# EasyEDA Pro project MasterCtrl.eprj, schematic MasterSchematic

## Sheets
1 MasterCore: Board Name: Board1; Create Date: 2025-06-09; Page Name: MasterCore; Project Name: MasterCtrl_v1_0_4; Schematic Name: Schematic1; Update Date: 2025-06-09; Company: 嘉立创EDA; Drawed: 王大智; Page Size: A4; Version: V1.0
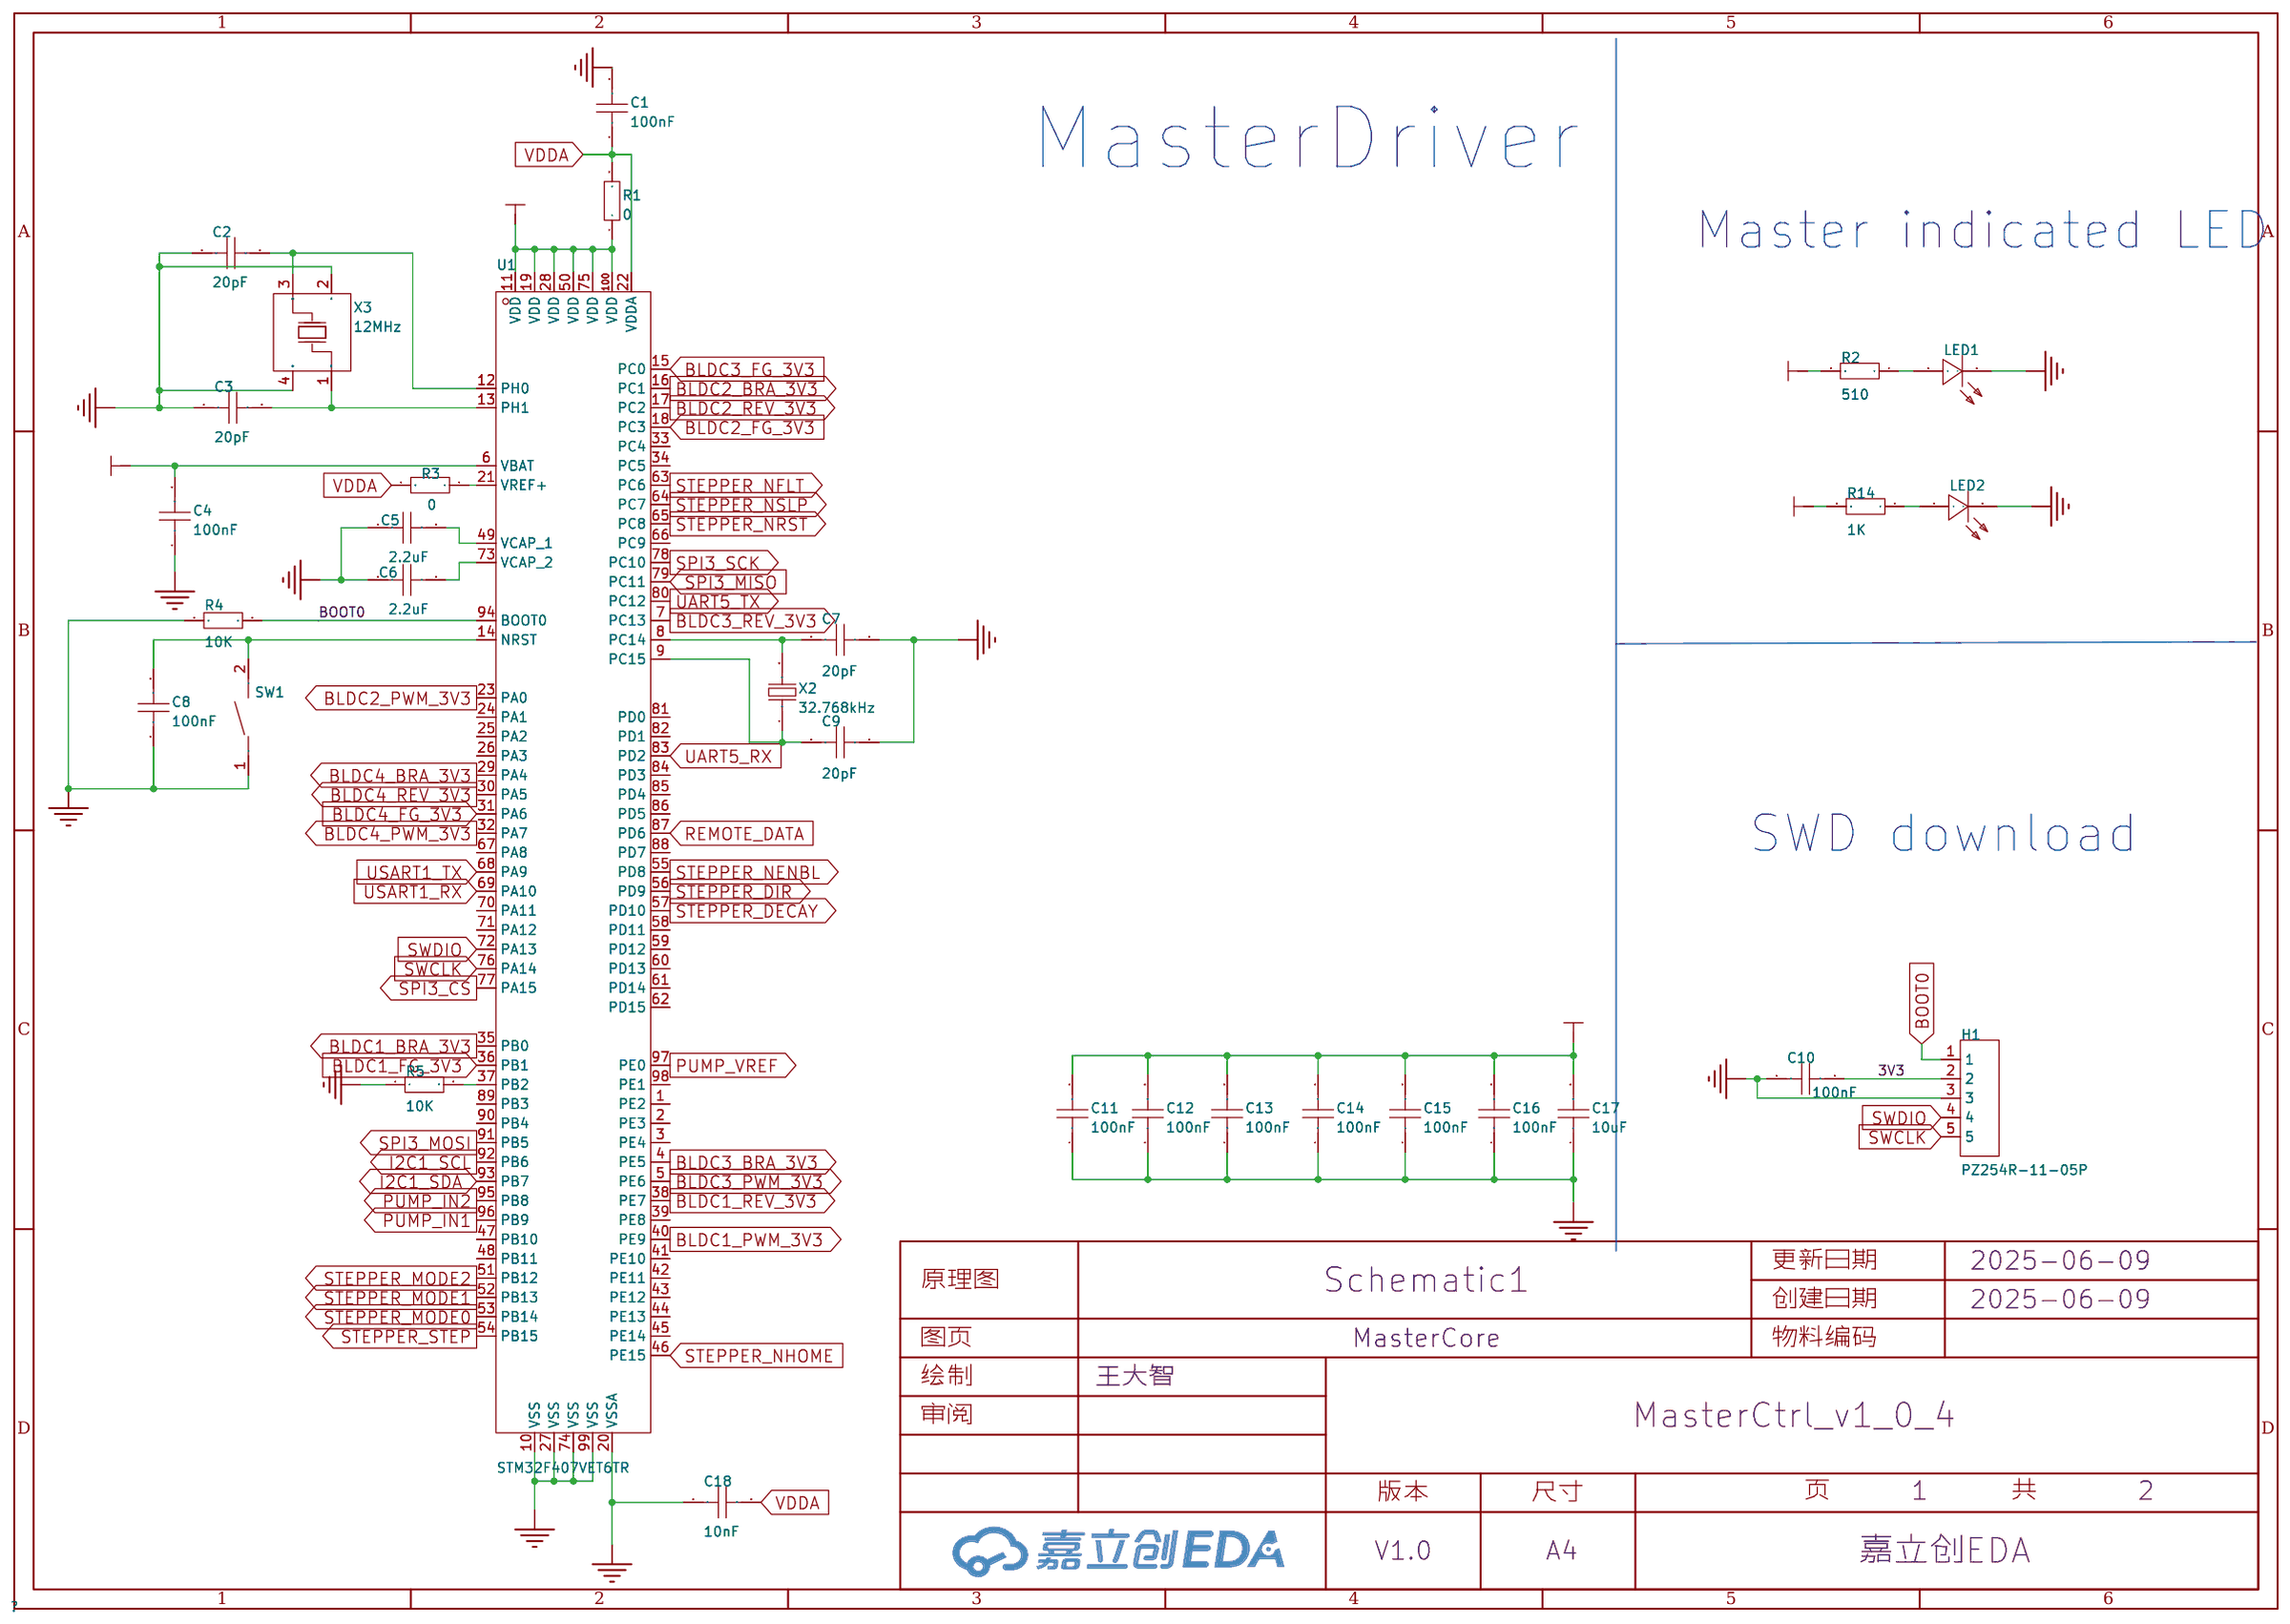
[diagram p0: MasterCore]
2 MasterExternal: Page Name: ExternalCircuit
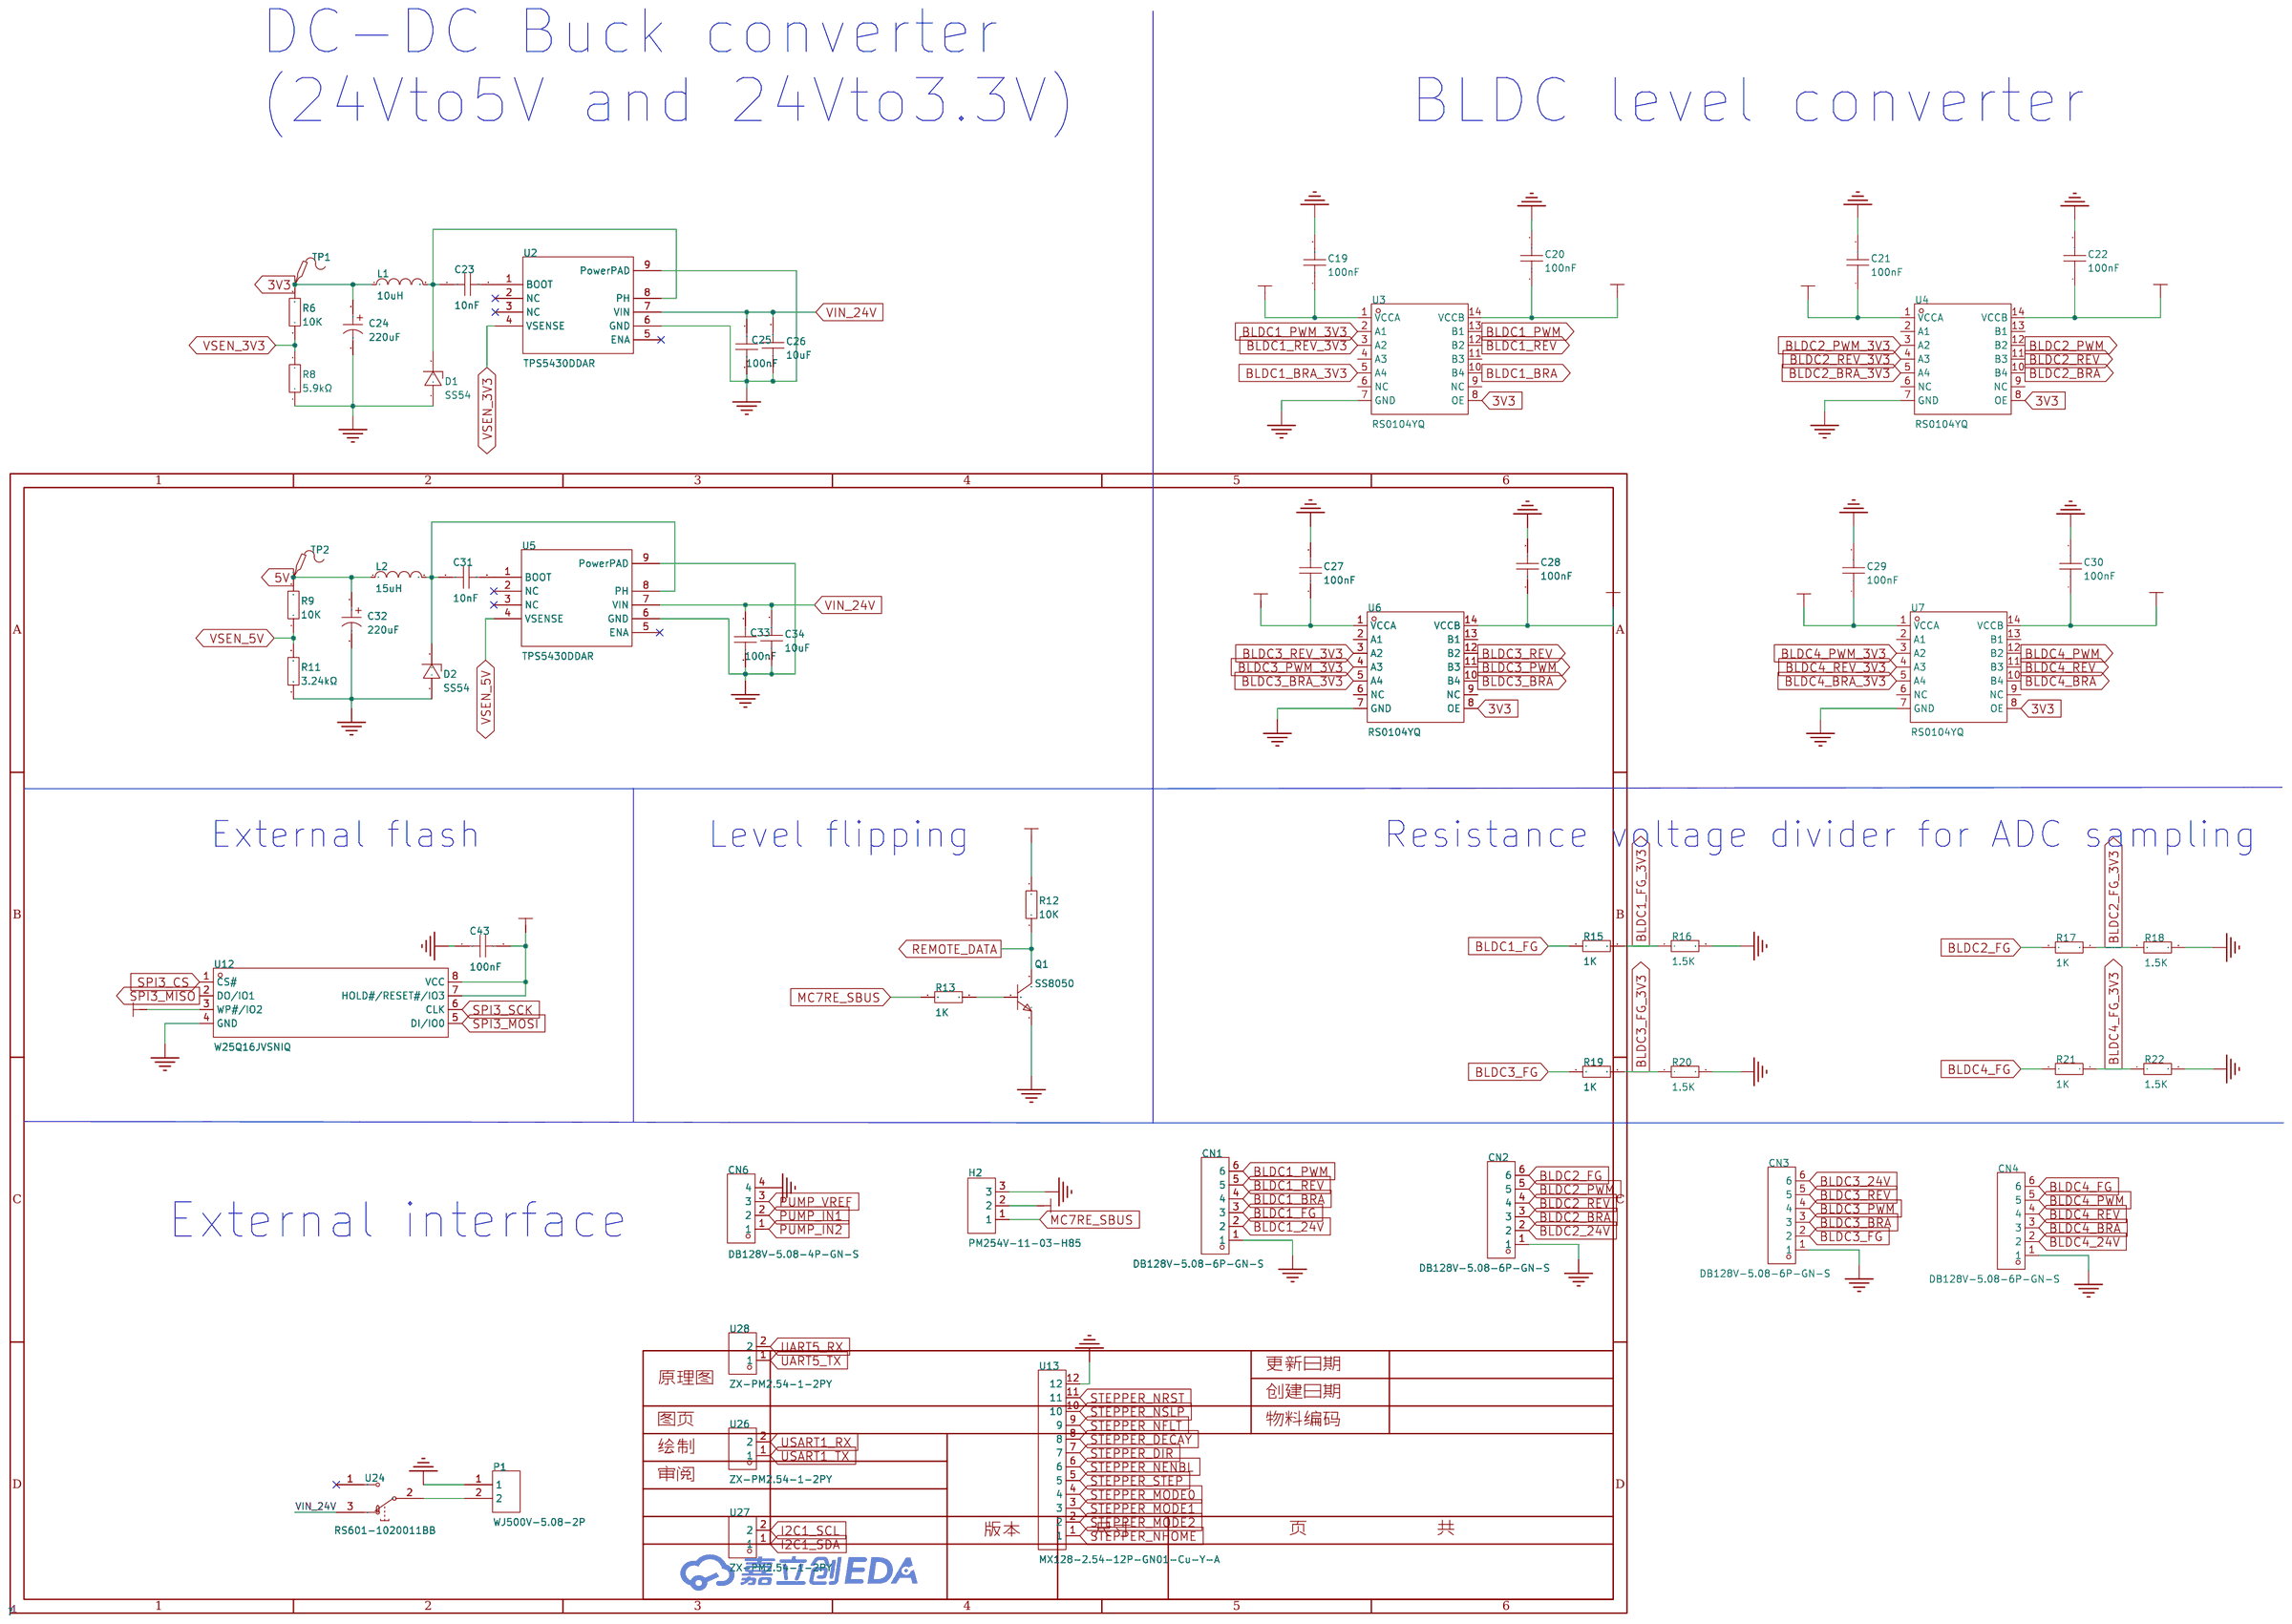
[diagram p1: MasterExternal]

## Parts
sheet MasterCore
C1  100nF  [C0603]
C2  20pF  [C0603]
C3  20pF  [C0603]
C4  100nF  [C0603]
C5  2.2uF  [C0603]
C6  2.2uF  [C0603]
C7  20pF  [C0603]
C8  100nF  [C0603]
C9  20pF  [C0603]
C10  100nF  [C0603]
C11  100nF  [C0603]
C12  100nF  [C0603]
C13  100nF  [C0603]
C14  100nF  [C0603]
C15  100nF  [C0603]
C16  100nF  [C0603]
C17  10uF  [C0603]
C18  10nF  [C0603]
H1  PZ254R-11-05P  [HDR-TH_5P-P2.54-H-M-W10.4]
LED1  SZYY0805R  [LED0805-R-RD]
LED2  SZYY0805R  [LED0805-R-RD]
R1  0  [R0603]
R2  510  [R0603]
R3  0  [R0603]
R4  10K  [R0603]
R5  10K  [R0603]
R14  1K  [R0603]
SW1  TS-1088-AR02016  [SW-SMD_L3.9-W3.0-P4.45]
U1  STM32F407VET6TR  [LQFP-100_L14.0-W14.0-P0.50-LS16.0-BL]
X2  32.768kHz  [FC-135R_L3.2-W1.5]
X3  12MHz  [CRYSTAL-SMD_4P-L3.2-W2.5-BL]
sheet MasterExternal
C19  100nF  [C0603]
C20  100nF  [C0603]
C21  100nF  [C0603]
C22  100nF  [C0603]
C23  10nF  [C0603]
C24  220uF  [CAP-SMD_BD8.0-L8.3-W8.3-FD]
C25  100nF  [C0603]
C26  10uF  [C1206]
C27  100nF  [C0603]
C28  100nF  [C0603]
C29  100nF  [C0603]
C30  100nF  [C0603]
C31  10nF  [C0603]
C32  220uF  [CAP-SMD_BD8.0-L8.3-W8.3-FD]
C33  100nF  [C0603]
C34  10uF  [C1206]
C43  100nF  [C0603]
CN1  DB128V-5.08-6P-GN-S  [CONN-TH_6P-P5.08_DIBO_DB128V-5.08]
CN2  DB128V-5.08-6P-GN-S  [CONN-TH_6P-P5.08_DIBO_DB128V-5.08]
CN3  DB128V-5.08-6P-GN-S  [CONN-TH_6P-P5.08_DIBO_DB128V-5.08]
CN4  DB128V-5.08-6P-GN-S  [CONN-TH_6P-P5.08_DIBO_DB128V-5.08]
CN6  DB128V-5.08-4P-GN-S  [CONN-TH_4P-P5.08_DIBO_DB128V-5.08]
D1  SS54  [SMA_L4.3-W2.6-LS5.0-FD]
D2  SS54  [SMA_L4.3-W2.6-LS5.0-FD]
H2  PM254V-11-03-H85  [HDR-TH_3P-P2.54-V-F]
L1  10uH  [IND-SMD_L7.3-W6.8]
L2  15uH  [IND-SMD_L7.0-W6.6_FXL0630]
P1  WJ500V-5.08-2P  [CONN-TH_2P-P5.00_WJ500V-5.08-2P]
Q1  SS8050  [SOT-23-3_L2.9-W1.3-P1.90-LS2.4-BR]
R6  10K  [R0603]
R8  5.9kΩ  [R0603]
R9  10K  [R0603]
R11  3.24kΩ  [R0603]
R12  10K  [R0603]
R13  1K  [R0603]
R15  1K  [R0603]
R16  1.5K  [R0603]
R17  1K  [R0603]
R18  1.5K  [R0603]
R19  1K  [R0603]
R20  1.5K  [R0603]
R21  1K  [R0603]
R22  1.5K  [R0603]
TP1  -  [Test-Point-0.5mm]
TP2  -  [Test-Point-0.5mm]
U2  TPS5430DDAR  [ESOP-8_L4.9-W3.9-P1.27-LS6.0-TL-EP]
U3  RS0104YQ  [TSSOP-14_L5.0-W4.4-P0.65-LS6.4-BL]
U4  RS0104YQ  [TSSOP-14_L5.0-W4.4-P0.65-LS6.4-BL]
U5  TPS5430DDAR  [ESOP-8_L4.9-W3.9-P1.27-LS6.0-TL-EP]
U6  RS0104YQ  [TSSOP-14_L5.0-W4.4-P0.65-LS6.4-BL]
U7  RS0104YQ  [TSSOP-14_L5.0-W4.4-P0.65-LS6.4-BL]
U12  W25Q16JVSNIQ  [SOP-8_L4.9-W3.9-P1.27-LS6.0-BL]
U13  MX128-2.54-12P-GN01-Cu-Y-A  [CONN-TH_12P-P2.54_MX128-2.54-12P-GN01-CU-Y-A]
U24  RS601-1020011BB  [SW-TH_RS601-1020011BB]
U26  ZX-PM2.54-1-2PY  [HDR-TH_2P-P2.54-V-F]
U27  ZX-PM2.54-1-2PY  [HDR-TH_2P-P2.54-V-F]
U28  ZX-PM2.54-1-2PY  [HDR-TH_2P-P2.54-V-F]

## Library data of the parts
C1-C23 C25 C27-C31 C33 C43 = CAP_0603: Supplier Footprint: 0603
H1 = PZ254R-11-05P: 插针结构:1x5P;间距:2.54mm;行距:-;圆针/方针:方针;安装方式:弯插;排数:单排;总PIN位数:5P;额定电流:-;额定电压:-;配合针长度:6mm;塑高:2.5mm;触头材质:黄铜;触头镀层:-;工作温度:-40℃~+105℃;颜色:黑色;; LCSC Part Name: 1x5P 间距:2.54mm 方针 弯插; Supplier Part: C492413; Manufacturer: XFCN(兴飞); Supplier Footprint: 弯插,P=2.54mm; JLCPCB Part Class: 扩展库; Datasheet: https://atta.szlcsc.com/upload/public/pdf/source/20200309/C492413_82088D06BDD816AEC12FB986624DD327.pdf; Supplier: LCSC; Pin Structure: 1x5P; Pitch: 2.54mm; Circluar Pins/Square Pins: 方针; Mounting Type: 弯插; Number of Rows: 单排; Number of Pins: 5P; Length of Mating Pin: 6mm; Insulation Height: 2.5mm; Contact Material: 黄铜; Operating Temperature: -40℃~+105℃; Color: 黑色
LED1 LED2 = SZYY0805R: 发光颜色:红色;功率:40mW;正向电流:10mA;主波长:615nm~630nm;二极管配置:-;透镜颜色:无色透明透镜;色温:-;发光角度:120°;载带方式:-;工作温度:-40℃~+85℃;; LCSC Part Name: 红灯; Supplier Part: C434431; Manufacturer: yongyu(永裕光电); Supplier Footprint: 0805; JLCPCB Part Class: 扩展库; Datasheet: https://atta.szlcsc.com/upload/public/pdf/source/20191204/C434431_431C171B758FE4C37FA40B1B295AA7AB.pdf; Supplier: LCSC; Emitted Color: 红色; Power Dissipation: 40mW; Forward Current: 10mA; Dominant Wavelength: 615nm~630nm; Peak Wavelength: 645nm; Lens Color: 无色透明透镜; Viewing Angle: 120°; Operating Temperature: -40℃~+85℃
R1-R6 R9 R12-R22 = Res_0603: Supplier Footprint: 0603
SW1 = TS-1088-AR02016: 电路结构:单刀单掷;按钮形状:圆形按钮;作用力:160gf;安装方式:立贴;开关长度:4mm;开关宽度:3mm;开关高度:2mm;带支架:不带;触点电流:50mA;额定电压(DC):12V;绝缘电阻:100MΩ;机械寿命:10万次;; LCSC Part Name: 4*3*2mm 立贴 轻触开关; Supplier Part: C720477; Manufacturer: XUNPU(讯普); Supplier Footprint: SMD; JLCPCB Part Class: 扩展库; Datasheet: https://atta.szlcsc.com/upload/public/pdf/source/20200810/C720475_60D09DD6C54279ADDB2DC25100F1CC11.pdf; Supplier: LCSC; Circuit: 单刀单掷; Actuator Style: 圆形按钮; Operating Force: 160gf; Mounting Style: 立贴; Switch Length: 4mm; Switch Width: 3mm; Switch Height: 2mm; Strike Gundam: 不带; Contact Current: 50mA; Voltage Rating (DC): 12V; Insulation Resistance: 100MΩ; Actuator/Cap Color: 黑色; Pin Style: SMD接片; Mechanical Life: 10万次; Operating Temperature: -30℃~+80℃
U1 = STM32F407VET6TR: CPU内核:ARM-M4;CPU最大主频:168MHz;应用领域:-;; LCSC Part Name: 带DSP和FPU的高性能基础系列ARM Cortex-M4 MCU，具有512 KB Flash、168 MHz CPU、ART加速器、以太网和FSMC; Supplier Part: C5269943; Manufacturer: ST(意法半导体); Supplier Footprint: LQFP-100(14x14); JLCPCB Part Class: 扩展库; Datasheet: https://atta.szlcsc.com/upload/public/pdf/source/20201130/C919362_39400D478C258148B3DF984CE4A4041A.pdf; Supplier: LCSC; CPU Core: ARM-M4; CPU Maximum Speed: 168MHz; Number of I/O: 82; ADC (Bit): 12bit; DAC (Bit): 12bit; Low Voltage Detection Threshold: 1.8V~3.6V
X2 = Q13FC13500004_C32346: 晶振类型:贴片晶振;频率:32.768kHz;常温频差:±20ppm;负载电容:12.5pF;; LCSC Part Name: 32.768kHz ±20ppm 12.5pF; Supplier Part: C32346; Manufacturer: EPSON(爱普生); Manufacturer Part: Q13FC13500004; Supplier Footprint: SMD3215-2P; JLCPCB Part Class: 基础库; Datasheet: https://atta.szlcsc.com/upload/public/pdf/source/20240418/0E0FF5F0356BA3753F616001439D1416.pdf; Supplier: LCSC; Crystal Type: 贴片晶振; Normal temperature Frequency Tolerance: ±20ppm; Load Capacitor: 12.5pF; Equivalent Series Resistance (ESR): 70kΩ; Operating Temperature: -40℃~+85℃
X3 = X322512MSB4SI: 晶振类型:贴片晶振;频率:12MHz;常温频差:±10ppm;负载电容:20pF;频率稳定度:±20ppm;; LCSC Part Name: YSX321SL 12MHZ 4P 3225 20PF ±10PPM -40~85℃ (±20PPM); Supplier Part: C9002; Manufacturer: YXC(扬兴晶振); Supplier Footprint: SMD3225-4P; JLCPCB Part Class: 基础库; Datasheet: https://atta.szlcsc.com/upload/public/pdf/source/20240329/19D5F850207469550BEB00D7DFEDBC7A.pdf; Supplier: LCSC; Type: 贴片晶振; Normal temperature Frequency Tolerance: ±10ppm; Load Capacitance: 20pF; Frequency Stability: ±20ppm; Operating Temperature: -40℃~+85℃
C24 C32 = GVT1V227M0810CNVC: 容值:220uF;精度:±20%;额定电压:35V;纹波电流:175mA@120Hz;; LCSC Part Name: 220uF ±20% 35V; Supplier Part: C2983323; Manufacturer: HRK(鸿瑞凯电子); Supplier Footprint: SMD,D8xL10.5mm; JLCPCB Part Class: 扩展库; Datasheet: https://atta.szlcsc.com/upload/public/pdf/source/20220321/BA17E910A44EA2B508CDD6AB8BA576BA.pdf; Supplier: LCSC; Tolerance: ±20%; Rated Voltage: 35V; Ripple Current: 175mA@120Hz; φD: 8mm; L: 10.5mm; Lifetime @ Temp: 2000hrs@105℃; Operating Temperature: -55℃~+105℃
C26 C34 = HGC1206R5106K500NSPJ: 容值:10uF;精度:±10%;额定电压:50V;温度系数:X5R;; LCSC Part Name: 10uF ±10% 50V; Supplier Part: C7432781; Manufacturer: Chinocera(华瓷); Supplier Footprint: 1206; JLCPCB Part Class: 扩展库; Datasheet: https://atta.szlcsc.com/upload/public/pdf/source/20240320/FAC3FEC40A78BC5CCCE96C232A94D860.pdf; Supplier: LCSC; Tolerance: ±10%; Voltage Rating: 50V; Temperature Coefficient: X5R
CN1-CN4 = DB128V-5.08-6P-GN-S: 结构:1x6P;间距:5.08mm;颜色:绿色;安装方式:直插;额定电流:20A;额定电压:300V;排数:1;线规 - AWG:12~30;线规 - 平方毫米:2.5;每排PIN数:6;工作温度范围:-40℃~+105℃;; LCSC Part Name: 5.08mm 1x6P 排数:1 每排P数:6 直插; Supplier Part: C2915642; Manufacturer: DORABO(地博电气); Supplier Footprint: 插件,P=5.08mm; JLCPCB Part Class: 扩展库; Datasheet: https://atta.szlcsc.com/upload/public/pdf/source/20230106/CC449C10514519CDCE20F1C37DBF2DAC.pdf; Supplier: LCSC; Structure: 1x6P; Pitch: 5.08mm; Color: 绿色; Mounting Style: 直插; Current Rating (Max): 20A; Voltage Rating (Max): 300V; Number of Pins: 6P; Number of Rows: 1; Wire Gauge - AWG: 12~30; Wire Gauge - mm2: 2.5; Number of PINs Per Row: 6; Operating Temperature Range: -40℃~+105℃
CN6 = DB128V-5.08-4P-GN-S: 结构:1x4P;间距:5.08mm;颜色:绿色;安装方式:直插;排数:1;每排PIN数:4;额定电流:16A;额定电压:300V;线规 - AWG:12~22;线规 - 平方毫米:2.5;工作温度:-40℃~+105℃;; LCSC Part Name: 1x4P 5.08mm 直插 排数:1 每排P数:4; Supplier Part: C2915641; Manufacturer: DORABO(地博电气); Supplier Footprint: 插件,P=5.08mm; JLCPCB Part Class: 扩展库; Datasheet: https://atta.szlcsc.com/upload/public/pdf/source/20230106/CC449C10514519CDCE20F1C37DBF2DAC.pdf; Supplier: LCSC; Number of Positions or Pins: 1x4P; Pitch: 5.08mm; Color: 绿色; Mounting Type: 直插; Number of Pins: 4P; Number of Rows: 1; Number of PINs Per Row: 4; Screw Specification: M2.5; Current Rating: 16A; Voltage Rating (Max): 300V; Wire Gauge - AWG: 12~22; Wire Gauge - mm2: 2.5; Operating Temperature: -40℃~+105℃
D1 D2 = SS54_C7420369: 二极管配置:独立式;正向压降(Vf):550mV@5.0A;直流反向耐压(Vr):40V;整流电流:5A;; LCSC Part Name: 电压:40V 电流:5A; Supplier Part: C7420369; Manufacturer: 宏迦橙; Supplier Footprint: SMA(DO-214AC); JLCPCB Part Class: 扩展库; Datasheet: https://atta.szlcsc.com/upload/public/pdf/source/20230828/254C3882F8647358AD9F60DD73611B5E.pdf; Supplier: LCSC; Diode Configuration: 独立式; Forward Voltage (Vf@If): 550mV@5.0A; Reverse Voltage (Vr): 40V; Rectified Current: 5A; Reverse Leakage Current (Ir): 50uA@40V
H2 = PM254V-11-03-H85: 插孔结构:1x3P;间距:2.54mm;行距:-;安装类型:直插;排数:单排;总孔位数:3P;塑高:-;触头材质:黄铜;触头镀层:-;; LCSC Part Name: 间距:2.54mm 1x3P 直插; Supplier Part: C541850; Manufacturer: XFCN(兴飞); Supplier Footprint: 插件,P=2.54mm; JLCPCB Part Class: 扩展库; Datasheet: https://atta.szlcsc.com/upload/public/pdf/source/20200518/C541849_85853D71FC67C51915A806977A588FDA.pdf; Supplier: LCSC; Holes Structure: 1x3P; Pitch: 2.54mm; Mounting Type: 直插; Number of Rows: 单排; Number of Holes: 3P; Contact Material: 黄铜
L1 = FXL0630-100-M: 电感值:10uH;精度:±20%;额定电流:4.5A;饱和电流(Isat):5.5A;类型:一体成型电感;; LCSC Part Name: 10uH ±20% 5.5A; Supplier Part: C167223; Manufacturer: cjiang(长江微电); Supplier Footprint: SMD,6.6x7mm; JLCPCB Part Class: 扩展库; Datasheet: https://atta.szlcsc.com/upload/public/pdf/source/20240426/3189EA8206330E2108542F9E34E540E7.pdf; Supplier: LCSC; Tolerance: ±20%; Rated Current: 4.5A; Saturation Current (Isat): 5.5A; DC Resistance (DCR): 68mΩ; Type: 一体成型电感
L2 = FXL0630-150-M: 电感值:15uH;精度:±20%;额定电流:3A;饱和电流(Isat):4.5A;类型:一体成型电感;; LCSC Part Name: 15uH ±20% 4.5A; Supplier Part: C177243; Manufacturer: cjiang(长江微电); Supplier Footprint: SMD,6.6x7mm; JLCPCB Part Class: 扩展库; Datasheet: https://atta.szlcsc.com/upload/public/pdf/source/20240426/3189EA8206330E2108542F9E34E540E7.pdf; Supplier: LCSC; Tolerance: ±20%; Rated Current: 3A; Saturation Current (Isat): 4.5A; DC Resistance (DCR): 115mΩ; Type: 一体成型电感
P1 = WJ500V-5.08-2P: 结构:1x2P;间距:5.08mm;颜色:绿色;安装方式:直插;额定电流:18A;额定电压:250V;排数:1;线规 - AWG:14~30;线规 - 平方毫米:2.5;每排PIN数:2;触头材质:-;触头镀层:-;工作温度范围:-40℃~+105℃;焊接温度(最大值):-;; LCSC Part Name: 1x2P 5.08mm 直插 排数:1 每排P数:2; Supplier Part: C8465; Manufacturer: KANGNEX(康奈克斯电气); Supplier Footprint: 插件,P=5.08mm; JLCPCB Part Class: 扩展库; Datasheet: https://atta.szlcsc.com/upload/public/pdf/source/20191225/C8465_02D34CE5B5B4A53DF5891601D97FA9F4.pdf; Supplier: LCSC; Structure: 1x2P; Pitch: 5.08mm; Color: 绿色; Mounting Style: 直插; Current Rating (Max): 18A; Voltage Rating (Max): 250V; Number of Pins: 2P; Number of Rows: 1; Wire Gauge - AWG: 14~30; Wire Gauge - mm2: 2.5; Number of PINs Per Row: 2; Operating Temperature Range: -40℃~+105℃; Screw Specification: M2.5
Q1 = SS8050_C7420370: 晶体管类型:NPN;集电极电流(Ic):1.5A;集射极击穿电压(Vceo):25V;耗散功率(Pd):300mW;直流电流增益(hFE):120@100mA,1.0V;; LCSC Part Name: H档 200-350; Supplier Part: C7420370; Manufacturer: 宏嘉诚; Supplier Footprint: SOT-23; JLCPCB Part Class: 扩展库; Datasheet: https://atta.szlcsc.com/upload/public/pdf/source/20250205/5DB94E86981B5B1A1866D18E379C0D4F.pdf; Supplier: LCSC; type: NPN; Current - Collector(Ic): 1.5A; Collector - Emitter Voltage VCEO: 25V; Pd - Power Dissipation: 300mW; DC Current Gain: 120@100mA,1.0V; Transition frequency(fT): 100MHz; Current - Collector Cutoff: 100nA; Vce Saturation(VCE(sat)): 500mV; Operating Temperature: -55℃~+150℃
R8 = 0603WAF5901T5E: 电阻类型:厚膜电阻;阻值:5.9kΩ;精度:±1%;功率:100mW;最大工作电压:75V;温度系数:±100ppm/℃;; LCSC Part Name: 5.9kΩ ±1% 100mW 厚膜电阻; Supplier Part: C23071; Manufacturer: UNI-ROYAL(厚声); Supplier Footprint: 0603; JLCPCB Part Class: 扩展库; Datasheet: https://atta.szlcsc.com/upload/public/pdf/source/20200306/C422600_1E6D84923E4A46A82E41ADD87F860B5C.pdf; Supplier: LCSC; Type: 厚膜电阻; Tolerance: ±1%; Power(Watts): 100mW; Overload Voltage (Max): 75V; Temperature Coefficient: ±100ppm/℃; Operating Temperature Range: -55℃~+155℃
R11 = 0603WAF3241T5E: 电阻类型:厚膜电阻;阻值:3.24kΩ;精度:±1%;功率:100mW;最大工作电压:75V;温度系数:±100ppm/℃;; LCSC Part Name: 3.24kΩ ±1% 100mW 厚膜电阻; Supplier Part: C22994; Manufacturer: UNI-ROYAL(厚声); Supplier Footprint: 0603; JLCPCB Part Class: 扩展库; Datasheet: https://atta.szlcsc.com/upload/public/pdf/source/20200306/C422600_1E6D84923E4A46A82E41ADD87F860B5C.pdf; Supplier: LCSC; Type: 厚膜电阻; Tolerance: ±1%; Power(Watts): 100mW; Overload Voltage (Max): 75V; Temperature Coefficient: ±100ppm/℃; Operating Temperature Range: -55℃~+155℃
TP1 TP2 = Test-Point: Test Point 测试点
U2 U5 = TPS5430DDAR: 功能类型:降压型;输出类型:可调;工作电压:5.5V~36V;输出电压:1.221V~32.04V;输出电流:3A;; LCSC Part Name: 宽输入范围、3A输出电流的降压转换器; Supplier Part: C9864; Manufacturer: TI(德州仪器); Supplier Footprint: SOIC-8-EP; JLCPCB Part Class: 基础库; Datasheet: https://www.ti.com/cn/lit/gpn/tps5430; Supplier: LCSC; Function: 降压型; Output Type: 可调; Input Voltage: 5.5V~36V; Output Voltage: 1.221V~32.04V; Output Current: 3A; Switching Frequency: 500kHz; Operating Temperature: -40℃~+125℃@(TJ); Synchronous Rectification: 否; Number of Outputs: 1; Topology: 降压式; Switch tube (built-in/external): 内置
U3 U4 U6 U7 = RS0104YQ: 数据速率:24Mbps;电压(VCCA):1.65V~5.5V;电压(VCCB):2.3V~5.5V;电路数:1;每个电路通道数:4;; Supplier Part: C2762288; Manufacturer: RUNIC(润石); Supplier Footprint: TSSOP-14; JLCPCB Part Class: 扩展库; Datasheet: https://atta.szlcsc.com/upload/public/pdf/source/20210326/C2762288_047AD9A0F3596B818F72E78761722A97.pdf; Supplier: LCSC; Channel Type: 双向; Data Rate: 24Mbps; Supply Voltage (VCCA): 1.65V~5.5V; Supply Voltage (VCCB): 2.3V~5.5V; Number of Circuits: 1; Channels per Circuit: 4; Output Type: 推挽式；开路漏极; Operating Temperature: -40℃~+85℃
U12 = W25Q16JVSNIQ_C2456211: Supplier Part: C2456211; Manufacturer: WINBOND(华邦); Supplier Footprint: SOIC-8; JLCPCB Part Class: 扩展库; Datasheet: https://atta.szlcsc.com/upload/public/pdf/source/20190529/C115407_78E5B4F96E7138D299EC51EC5982A1A5.pdf; Supplier: LCSC
U13 = MX128-2.54-12P-GN01-Cu-Y-A: 结构:1x12P;间距:2.54mm;颜色:绿色;安装方式:直插;排数:1;每排PIN数:12;额定电流:6A;额定电压:150V;线规 - AWG:18~24;线规 - 平方毫米:1;工作温度:-40℃~+105℃;; LCSC Part Name: 1x12P 2.54mm 直插 排数:1 每排P数:12; Supplier Part: C5188451; Manufacturer: MAX(迈旭); Supplier Footprint: 插件,P=2.54mm; JLCPCB Part Class: 扩展库; Datasheet: https://atta.szlcsc.com/upload/public/pdf/source/20250320/39CF67EAC718F5AC600D0D1AE915BA0E.pdf; Supplier: LCSC; Number of Positions or Pins: 1x12P; Pitch: 2.54mm; Color: 绿色; Mounting Type: 直插; Number of Pins: 12P; Number of Rows: 1; Number of PINs Per Row: 12; Screw Specification: M1.6; Current Rating: 6A; Voltage Rating (Max): 150V; Wire Gauge - AWG: 18~24; Wire Gauge - mm2: 1; Operating Temperature: -40℃~+105℃
U24 = RS601-1020011BB: 带灯:无;引脚样式:焊片;额定电流:8A;额定电压(AC):250V;额定电压(DC):-;电路结构:单刀双掷;机械寿命:1万次;; Supplier Part: C2885784; Manufacturer: HCTL(华灿天禄); Supplier Footprint: 插件; JLCPCB Part Class: 扩展库; Datasheet: https://atta.szlcsc.com/upload/public/pdf/source/20210820/EDA204CBF6D3843A462B7BF46F14BDE3.pdf; Supplier: LCSC; Switch Length: 21mm; Switch Width: 15mm; Switch Height: 13.6mm; Actuator Type: 凹面弯曲; With Lamp: 无; Pin Style: 焊片; Actuator Color: 黑色; Contact Current: 8A; Voltage Rating (AC): 250V; Circuit: 单刀双掷; Mechanical Life: 1万次; Operating Temperature: -25℃~+85℃; Actuator Identifier: - O
U26-U28 = ZX-PM2.54-1-2PY: 插孔结构:1x2P;间距:2.54mm;行距:-;圆孔/方孔:方孔;安装类型:直插;排数:单排;总孔位数:2P;额定电流:-;额定电压:1kV;插孔方向:顶部;塑高:8.5mm;触头材质:-;触头镀层:金;工作温度范围:-40℃~+105℃;焊接温度(最大值):260℃@5S;; LCSC Part Name: 1x2P 间距:2.54mm 直插; Supplier Part: C7499322; Manufacturer: Megastar(兆星); Supplier Footprint: 插件,P=2.54mm; JLCPCB Part Class: 扩展库; Datasheet: https://atta.szlcsc.com/upload/public/pdf/source/20231122/F22175ABE3DCBFEB9E36A2E7DA44623C.pdf; Supplier: LCSC; Holes Structure: 1x2P; Pitch: 2.54mm; Circular Hole / Square Hole: 方孔; Mounting Type: 直插; Number of Rows: 单排; Number of Holes: 2P; Voltage Rating (Max): 1kV; Holes Direction: 顶部; Insulation Height: 8.5mm; Contact Plating: 金; Operating Temperature Range: -40℃~+105℃; Soldering Temperature(Max): 260℃@5S

## Nets
3V3: C4.2 C10.2 C11.2 C12.2 C13.2 C14.2 C15.2 C16.2 C17.2 C19.1 C21.1 C24.1 C27.1 C29.1 C43.2 H1.2 L1.1 R1.1 R2.2 R6.2 R12.2 TP1.1 U1.6(VBAT) U1.11(VDD) U1.19(VDD) U1.28(VDD) U1.50(VDD) U1.75(VDD) U1.100(VDD) U3.1(VCCA) U3.8(OE) U4.1(VCCA) U4.8(OE) U6.1(VCCA) U6.8(OE) U7.1(VCCA) U7.8(OE) U12.3(WP#/IO2) U12.7(HOLD#/RESET#/IO3) U12.8(VCC)
5V: C20.1 C22.1 C28.1 C30.1 C32.1 H2.2 L2.1 R9.2 R14.2 TP2.1 U3.14(VCCB) U4.14(VCCB) U6.14(VCCB) U7.14(VCCB)
GND: C1.2 C2.1 C3.1 C4.1 C5.1 C6.1 C7.1 C8.1 C9.1 C10.1 C11.1 C12.1 C13.1 C14.1 C15.1 C16.1 C17.1 C18.1 C19.2 C20.2 C21.2 C22.2 C24.2 C25.2 C26.1 C27.2 C28.2 C29.2 C30.2 C32.2 C33.2 C34.1 C43.1 CN1.1 CN2.1 CN3.1 CN4.1 CN6.4 D1.1(A) D2.1(A) H1.3 H2.3 LED1.2(-) LED2.2(-) P1.1 Q1.2(E) R4.1 R5.1 R8.1 R11.1 R16.2 R18.2 R20.2 R22.2 SW1.1 U1.10(VSS) U1.20(VSSA) U1.27(VSS) U1.74(VSS) U1.99(VSS) U2.6(GND) U2.9(PowerPAD) U3.7(GND) U4.7(GND) U5.6(GND) U5.9(PowerPAD) U6.7(GND) U7.7(GND) U12.4(GND) U13.12 X3.2(GND) X3.4(GND)
VDDA: C1.1 C18.2 R1.2 R3.2 U1.22(VDDA)
VIN_24V: C25.1 C26.2 C33.1 C34.2 U2.7(VIN) U5.7(VIN) U24.3
BLDC1_24V: CN1.2
BLDC1_BRA: CN1.4 U3.10(B4)
BLDC1_BRA_3V3: U1.35(PB0) U3.5(A4)
BLDC1_FG: CN1.3 R15.1
BLDC1_FG_3V3: R15.2 R16.1 U1.36(PB1)
BLDC1_PWM: CN1.6 U3.13(B1)
BLDC1_PWM_3V3: U1.40(PE9) U3.2(A1)
BLDC1_REV: CN1.5 U3.12(B2)
BLDC1_REV_3V3: U1.38(PE7) U3.3(A2)
BLDC2_24V: CN2.2
BLDC2_BRA: CN2.3 U4.10(B4)
BLDC2_BRA_3V3: U1.16(PC1) U4.5(A4)
BLDC2_FG: CN2.6 R17.1
BLDC2_FG_3V3: R17.2 R18.1 U1.18(PC3)
BLDC2_PWM: CN2.5 U4.12(B2)
BLDC2_PWM_3V3: U1.23(PA0) U4.3(A2)
BLDC2_REV: CN2.4 U4.11(B3)
BLDC2_REV_3V3: U1.17(PC2) U4.4(A3)
BLDC3_24V: CN3.6
BLDC3_BRA: CN3.3 U6.10(B4)
BLDC3_BRA_3V3: U1.4(PE5) U6.5(A4)
BLDC3_FG: CN3.2 R19.1
BLDC3_FG_3V3: R19.2 R20.1 U1.15(PC0)
BLDC3_PWM: CN3.4 U6.11(B3)
BLDC3_PWM_3V3: U1.5(PE6) U6.4(A3)
BLDC3_REV: CN3.5 U6.12(B2)
BLDC3_REV_3V3: U1.7(PC13) U6.3(A2)
BLDC4_24V: CN4.2
BLDC4_BRA: CN4.3 U7.10(B4)
BLDC4_BRA_3V3: U1.29(PA4) U7.5(A4)
BLDC4_FG: CN4.6 R21.1
BLDC4_FG_3V3: R21.2 R22.1 U1.31(PA6)
BLDC4_PWM: CN4.5 U7.12(B2)
BLDC4_PWM_3V3: U1.32(PA7) U7.3(A2)
BLDC4_REV: CN4.4 U7.11(B3)
BLDC4_REV_3V3: U1.30(PA5) U7.4(A3)
BOOT0: H1.1 R4.2 U1.94(BOOT0)
I2C1_SCL: U1.92(PB6) U27.2
I2C1_SDA: U1.93(PB7) U27.1
MC7RE_SBUS: H2.1 R13.2
PUMP_IN1: CN6.2 U1.96(PB9)
PUMP_IN2: CN6.1 U1.95(PB8)
PUMP_VREF: CN6.3 U1.97(PE0)
REMOTE_DATA: Q1.3(C) R12.1 U1.87(PD6)
SPI3_CS: U1.77(PA15) U12.1(CS#)
SPI3_MISO: U1.79(PC11) U12.2(DO/IO1)
SPI3_MOSI: U1.91(PB5) U12.5(DI/IO0)
SPI3_SCK: U1.78(PC10) U12.6(CLK)
STEPPER_DECAY: U1.57(PD10) U13.8
STEPPER_DIR: U1.56(PD9) U13.7
STEPPER_MODE0: U1.53(PB14) U13.4
STEPPER_MODE1: U1.52(PB13) U13.3
STEPPER_MODE2: U1.51(PB12) U13.2
STEPPER_NENBL: U1.55(PD8) U13.6
STEPPER_NFLT: U1.63(PC6) U13.9
STEPPER_NHOME: U1.46(PE15) U13.1
STEPPER_NRST: U1.65(PC8) U13.11
STEPPER_NSLP: U1.64(PC7) U13.10
STEPPER_STEP: U1.54(PB15) U13.5
SWCLK: H1.5 U1.76(PA14)
SWDIO: H1.4 U1.72(PA13)
UART5_RX: U1.83(PD2) U28.2
UART5_TX: U1.80(PC12) U28.1
USART1_RX: U1.69(PA10) U26.2
USART1_TX: U1.68(PA9) U26.1
VSEN_3V3: R6.1 R8.2 U2.4(VSENSE)
VSEN_5V: R9.1 R11.2 U5.4(VSENSE)
$1N1804: C8.2 SW1.2 U1.14(NRST)
$1N1806: C5.2 U1.49(VCAP_1)
$1N1807: C6.2 U1.73(VCAP_2)
$1N1809: C3.2 U1.13(PH1) X3.1(OSC1)
$1N1810: C2.2 U1.12(PH0) X3.3(OSC2)
$1N1813: C7.2 U1.8(PC14) X2.2
$1N1814: C9.2 U1.9(PC15) X2.1
$1N1837: R3.1 U1.21(VREF+)
$1N1847: LED1.1(+) R2.1
$1N1851: R5.2 U1.37(PB2)
$1N4692: LED2.1(+) R14.1
$2N910: C23.2 U2.1(BOOT)
$2N911: C23.1 D1.2(K) L1.2 U2.8(PH)
$2N1501: C31.2 U5.1(BOOT)
$2N1502: C31.1 D2.2(K) L2.2 U5.8(PH)
$2N1872: Q1.1(B) R13.1
$2N5206: P1.2 U24.2

Not connected (* = marked no-connect by the designer): U1 1(PE2) 2(PE3) 3(PE4) 24(PA1) 25(PA2) 26(PA3) 33(PC4) 34(PC5) 39(PE8) 41(PE10) 42(PE11) 43(PE12) 44(PE13) 45(PE14) 47(PB10) 48(PB11) 58(PD11) 59(PD12) 60(PD13) 61(PD14) 62(PD15) 66(PC9) 67(PA8) 70(PA11) 71(PA12) 81(PD0) 82(PD1) 84(PD3) 85(PD4) 86(PD5) 88(PD7) 89(PB3) 90(PB4) 98(PE1); U2 2(NC)* 3(NC)* 5(ENA)*; U3 4(A3) 6(NC) 9(NC) 11(B3); U4 2(A1) 6(NC) 9(NC) 13(B1); U5 2(NC)* 3(NC)* 5(ENA)*; U6 2(A1) 6(NC) 9(NC) 13(B1); U7 2(A1) 6(NC) 9(NC) 13(B1); U24 1*

## Notes on the sheets
sheet 1
- MasterDriver
- Master indicated LED
- SWD download
sheet 2
- DC-DC Buck converter
  (24Vto5V and 24Vto3.3V)
- BLDC level converter
- External flash
- Level flipping
- Resistance voltage divider for ADC sampling
- External interface
